# EAGLE design EEZ DIB BP3C r1B4 (EAGLE 7.2.0)
Assembly variants: Farnell, TME

## Sheet 1 of 2
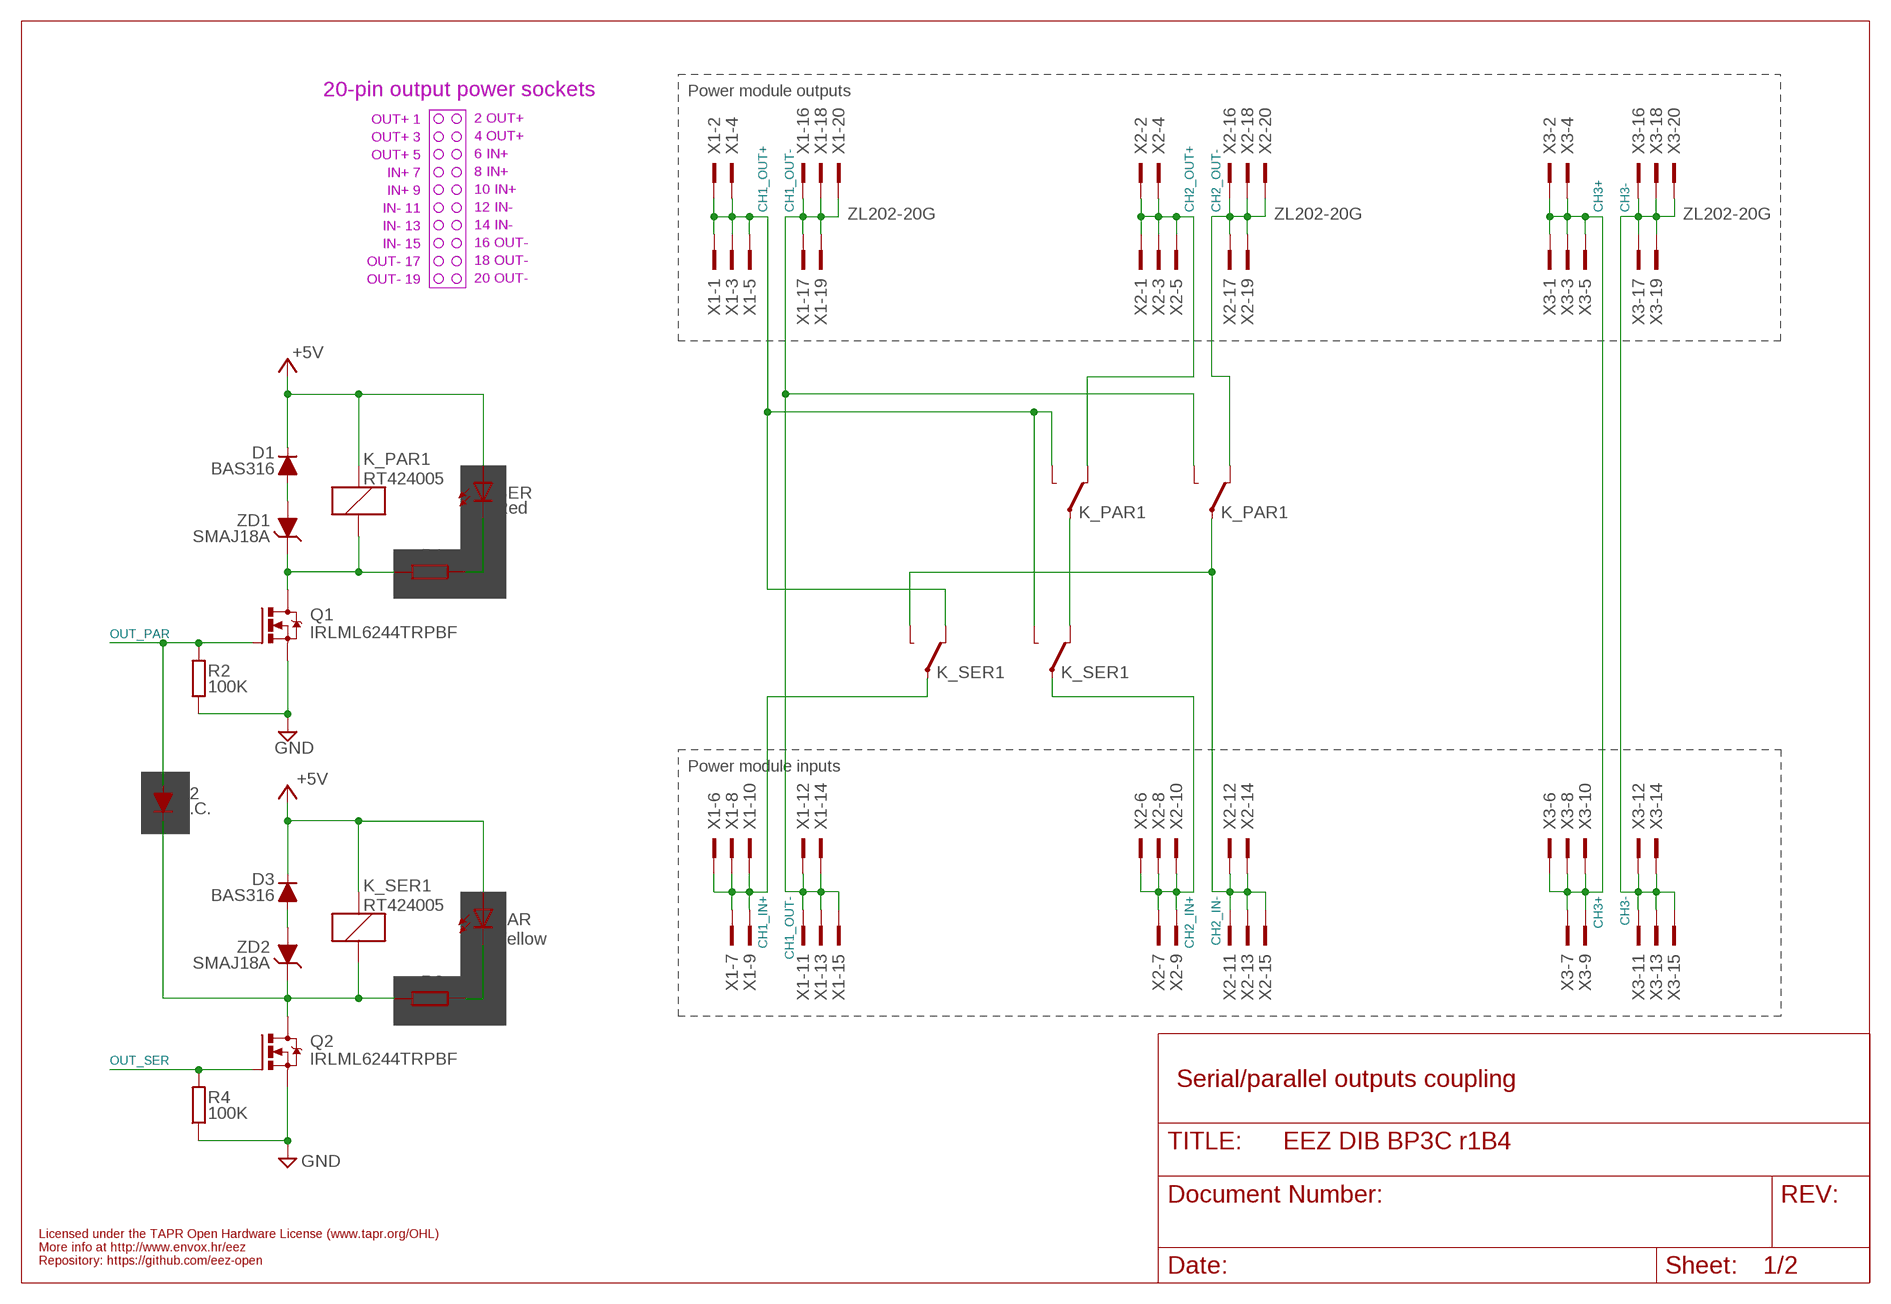
[diagram p0: schematic, sheet 1]

### Parts
D1  BAS316  DIODESOD323R  [SOD323-R]
D2  N.C.  DIODESOD323R  [SOD323-R]
D3  BAS316  DIODESOD323R  [SOD323-R]
K_PAR1  RT424005  RELAY_RT314012-2  [RT-C/016A5_ROUND]
K_SER1  RT424005  RELAY_RT314012-2  [RT-C/016A5_ROUND]
PAR  Yellow  LED0805  [LED_0805]
Q1  IRLML6244TRPBF  2N7002  [SOT103P240X110-3N]
Q2  IRLML6244TRPBF  2N7002  [SOT103P240X110-3N]
R1  330R  R-EU_R0805  [R0805]
R2  100K  R-EU_R0805  [R0805]
R3  330R  R-EU_R0805  [R0805]
R4  100K  R-EU_R0805  [R0805]
SER  Red  LED0805  [LED_0805]
X1  ZL202-20G  DS1021-210SF11  [DS1021-2*10SF11]
X2  ZL202-20G  DS1021-210SF11  [DS1021-2*10SF11]
X3  ZL202-20G  DS1021-210SF11  [DS1021-2*10SF11]
ZD1  SMAJ18A  PSMAXX  [DO214AC]
ZD2  SMAJ18A  PSMAXX  [DO214AC]

### Nets
+5V: D1.C D3.C K_PAR1.A2(K:C1) K_SER1.A2(K:C1) PAR.A SER.A ; also sheet 2
CH1_IN+: K_SER1.11A(-1:P) X1.6 X1.7 X1.8 X1.9 X1.10
CH1_OUT+: K_PAR1.14A(-1:O) K_SER1.12A(-1:S) K_SER1.14B(-2:O) X1.1 X1.2 X1.3 X1.4 X1.5
CH1_OUT-: K_PAR1.14B(-2:O) X1.11 X1.12 X1.13 X1.14 X1.15 X1.16 X1.17 X1.18 X1.19 X1.20
CH2_IN+: K_SER1.11B(-2:P) X2.6 X2.7 X2.8 X2.9 X2.10
CH2_IN-: K_PAR1.11B(-2:P) K_SER1.14A(-1:O) X2.11 X2.12 X2.13 X2.14 X2.15
CH2_OUT+: K_PAR1.12A(-1:S) X2.1 X2.2 X2.3 X2.4 X2.5
CH2_OUT-: K_PAR1.12B(-2:S) X2.16 X2.17 X2.18 X2.19 X2.20
CH3+: X3.1 X3.2 X3.3 X3.4 X3.5 X3.6 X3.7 X3.8 X3.9 X3.10
CH3-: X3.11 X3.12 X3.13 X3.14 X3.15 X3.16 X3.17 X3.18 X3.19 X3.20
GND: Q1.2(S) Q2.2(S) R2.1 R4.1 ; also sheet 2
N$1: K_PAR1.11A(-1:P) K_SER1.12B(-2:S)
N$7: PAR.C R3.1
N$8: R1.1 SER.C
N$101: D2.C K_SER1.A1(K:C2) Q2.3(D) R3.2 ZD2.C
N$102: K_PAR1.A1(K:C2) Q1.3(D) R1.2 ZD1.C
N$104: D3.A ZD2.A
N$128: D1.A ZD1.A
OUT_PAR: D2.A Q1.1(G) R2.2 ; also sheet 2
OUT_SER: Q2.1(G) R4.2 ; also sheet 2

### Notes on the sheet
- 20-pin output power sockets | Power module outputs
- OUT+ 1
- 2 OUT+
- OUT+ 3
- 4 OUT+
- OUT+ 5
- 6 IN+
- IN+ 7
- 8 IN+
- IN+ 9
- 10 IN+
- IN- 11
- 12 IN-
- IN- 13
- 14 IN-
- IN- 15
- 16 OUT-
- OUT- 17
- 18 OUT-
- OUT- 19
- 20 OUT-
- Power module inputs
- Serial/parallel outputs coupling
- Licensed under the TAPR Open Hardware License (www.tapr.org/OHL)
- More info at http://www.envox.hr/eez
- Repository: https://github.com/eez-open

## Sheet 2 of 2
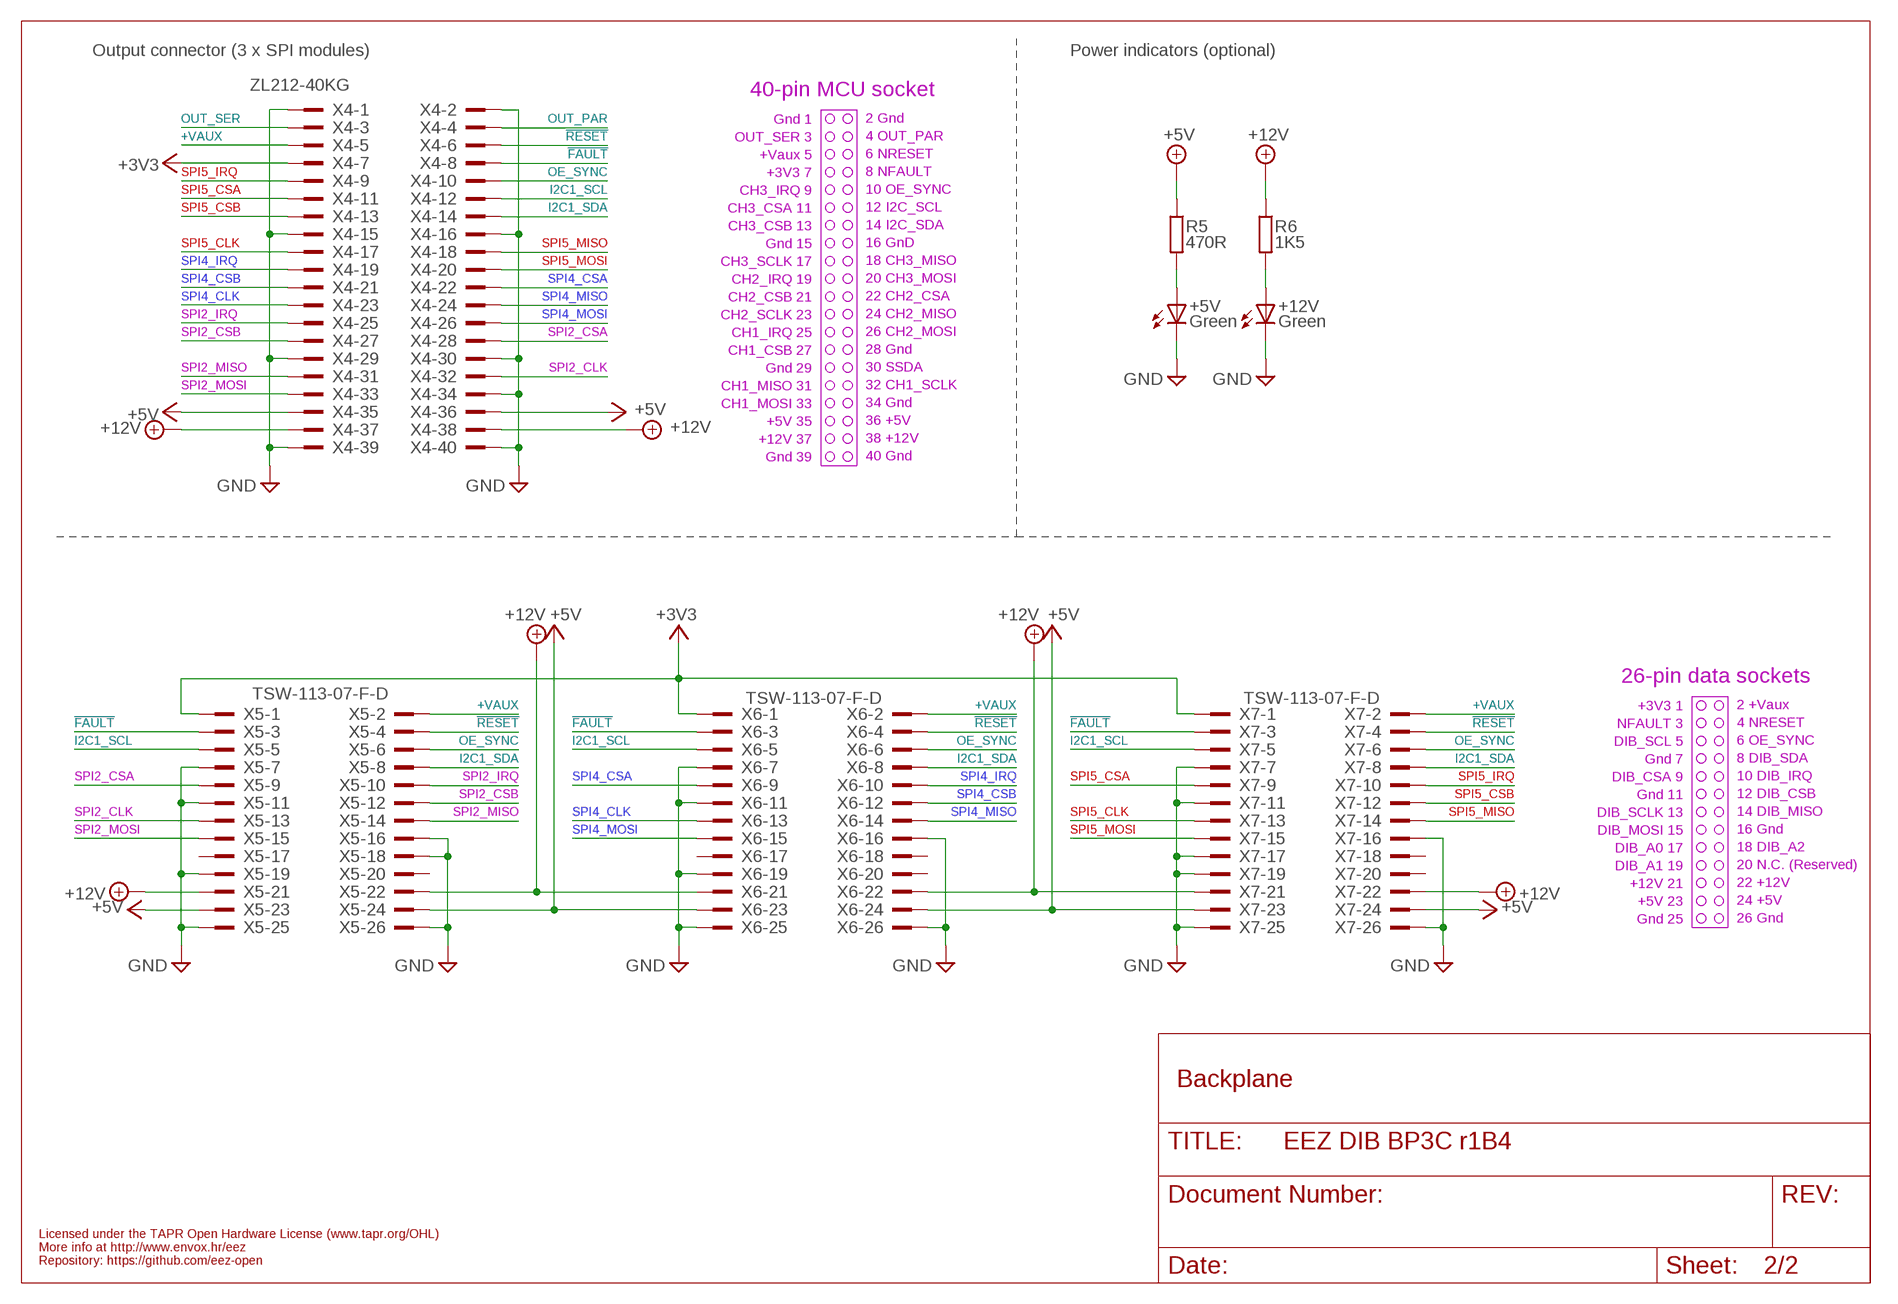
[diagram p1: schematic, sheet 2]

### Parts
+5V  Green  LED0805  [LED_0805]
+12V  Green  LED0805  [LED_0805]
R5  470R  R-EU_R0805  [R0805]
R6  1K5  R-EU_R0805  [R0805]
X4  ZL212-40KG  [ZL212-40KG]
X5  TSW-113-07-F-D  [TSW-113-07-F-D]
X6  TSW-113-07-F-D  [TSW-113-07-F-D]
X7  TSW-113-07-F-D  [TSW-113-07-F-D]

### Nets
!FAULT: X4.8 X5.3 X6.3 X7.3
!RESET: X4.6 X5.4 X6.4 X7.4
+3V3: X4.7 X5.1 X6.1 X7.1
+5V: R5.1 X4.35 X4.36 X5.23 X5.24 X6.23 X6.24 X7.23 X7.24 ; also sheet 1
+12V: R6.1 X4.37 X4.38 X5.21 X5.22 X6.21 X6.22 X7.21 X7.22
+VAUX: X4.5 X5.2 X6.2 X7.2
GND: +5V.C +12V.C X4.1 X4.2 X4.15 X4.16 X4.29 X4.30 X4.34 X4.39 X4.40 X5.7 X5.11 X5.16 X5.18 X5.19 X5.25 X5.26 X6.7 X6.11 X6.16 X6.19 X6.25 X6.26 X7.7 X7.11 X7.16 X7.17 X7.19 X7.25 X7.26 ; also sheet 1
I2C1_SCL: X4.12 X5.5 X6.5 X7.5
I2C1_SDA: X4.14 X5.8 X6.8 X7.8
N$3: +5V.A R5.2
N$4: +12V.A R6.2
OE_SYNC: X4.10 X5.6 X6.6 X7.6
OUT_PAR: X4.4 ; also sheet 1
OUT_SER: X4.3 ; also sheet 1
SPI2_CLK: X4.32 X5.13
SPI2_CSA: X4.28 X5.9
SPI2_CSB: X4.27 X5.12
SPI2_IRQ: X4.25 X5.10
SPI2_MISO: X4.31 X5.14
SPI2_MOSI: X4.33 X5.15
SPI4_CLK: X4.23 X6.13
SPI4_CSA: X4.22 X6.9
SPI4_CSB: X4.21 X6.12
SPI4_IRQ: X4.19 X6.10
SPI4_MISO: X4.24 X6.14
SPI4_MOSI: X4.26 X6.15
SPI5_CLK: X4.17 X7.13
SPI5_CSA: X4.11 X7.9
SPI5_CSB: X4.13 X7.12
SPI5_IRQ: X4.9 X7.10
SPI5_MISO: X4.18 X7.14
SPI5_MOSI: X4.20 X7.15
Unconnected: X5.17 X5.20 X6.17 X6.18 X6.20 X7.18 X7.20

### Notes on the sheet
- Output connector (3 x SPI modules) | Power indicators (optional)
- 40-pin MCU socket
- Gnd 1
- 2 Gnd
- OUT_SER 3
- 4 OUT_PAR
- +Vaux 5
- 6 NRESET
- +3V3 7
- 8 NFAULT
- CH3_IRQ 9
- 10 OE_SYNC
- CH3_CSA 11
- 12 I2C_SCL
- CH3_CSB 13
- 14 I2C_SDA
- Gnd 15
- 16 GnD
- CH3_SCLK 17
- 18 CH3_MISO
- CH2_IRQ 19
- 20 CH3_MOSI
- CH2_CSB 21
- 22 CH2_CSA
- CH2_SCLK 23
- 24 CH2_MISO
- CH1_IRQ 25
- 26 CH2_MOSI
- CH1_CSB 27
- 28 Gnd
- Gnd 29
- 30 SSDA
- CH1_MISO 31
- 32 CH1_SCLK
- CH1_MOSI 33
- 34 Gnd
- +5V 35
- 36 +5V
- +12V 37
- 38 +12V
- Gnd 39
- 40 Gnd
- 26-pin data sockets
- +3V3 1
- 2 +Vaux
- NFAULT 3
- 4 NRESET
- DIB_SCL 5
- 6 OE_SYNC
- Gnd 7
- 8 DIB_SDA
- DIB_CSA 9
- 10 DIB_IRQ
- Gnd 11
- 12 DIB_CSB
- DIB_SCLK 13
- 14 DIB_MISO
- DIB_MOSI 15
- 16 Gnd
- DIB_A0 17
- 18 DIB_A2
- DIB_A1 19
- 20 N.C. (Reserved)
- +12V 21
- 22 +12V
- +5V 23
- 24 +5V
- Gnd 25
- 26 Gnd
- Backplane
- Licensed under the TAPR Open Hardware License (www.tapr.org/OHL)
- More info at http://www.envox.hr/eez
- Repository: https://github.com/eez-open

## Library data of the parts
+5V +12V PAR SER = EEZ_Lib1:LED
D1-D3 = EEZ_Lib1:DIODE
K_PAR1 K_SER1 = EEZ_Lib1:RELAY_RT314012
Q1 Q2 = EEZ_Lib1:2N7002: N-CHANNEL ENHANCEMENT MODE FIELD EFFECT TRANSISTOR; MPN: 2N7002-7-F; OC_FARNELL: 1713823; OC_NEWARK: 25R5679; PACKAGE: SOT-23-3; SUPPLIER: DIODES INC.
R1-R6 = rcl:R-EU_: RESISTOR, European symbol
X1-X3 = EEZ_connectors:DS1021-2*10SF11: Pin header; pin strips; male; PIN:20; straight; 2.54mm; THT; 2x10; FARNELL: 2025179
X4 = EEZ_connectors:ZL212-40KG
X5-X7 = EEZ_connectors:TSW-113-07-F-D: Samtec TSW-110-07-F-D Header, 2.54MM, THT, 26-way; FARNELL: 2025182
ZD1 ZD2 = EEZ_Lib1:PSMAXX: Transient Voltage Suppressor, TVS, P4SMA Series, Unidirectional

## Net classes
0 default: width 0.152 mm, drill 0.3 mm, clearance 0.152 mm
1 diff: width 0.152 mm, drill 0.3 mm, clearance 0.152 mm
2 gnd: width 0.152 mm, drill 0.3 mm, clearance 0.152 mm

## Board
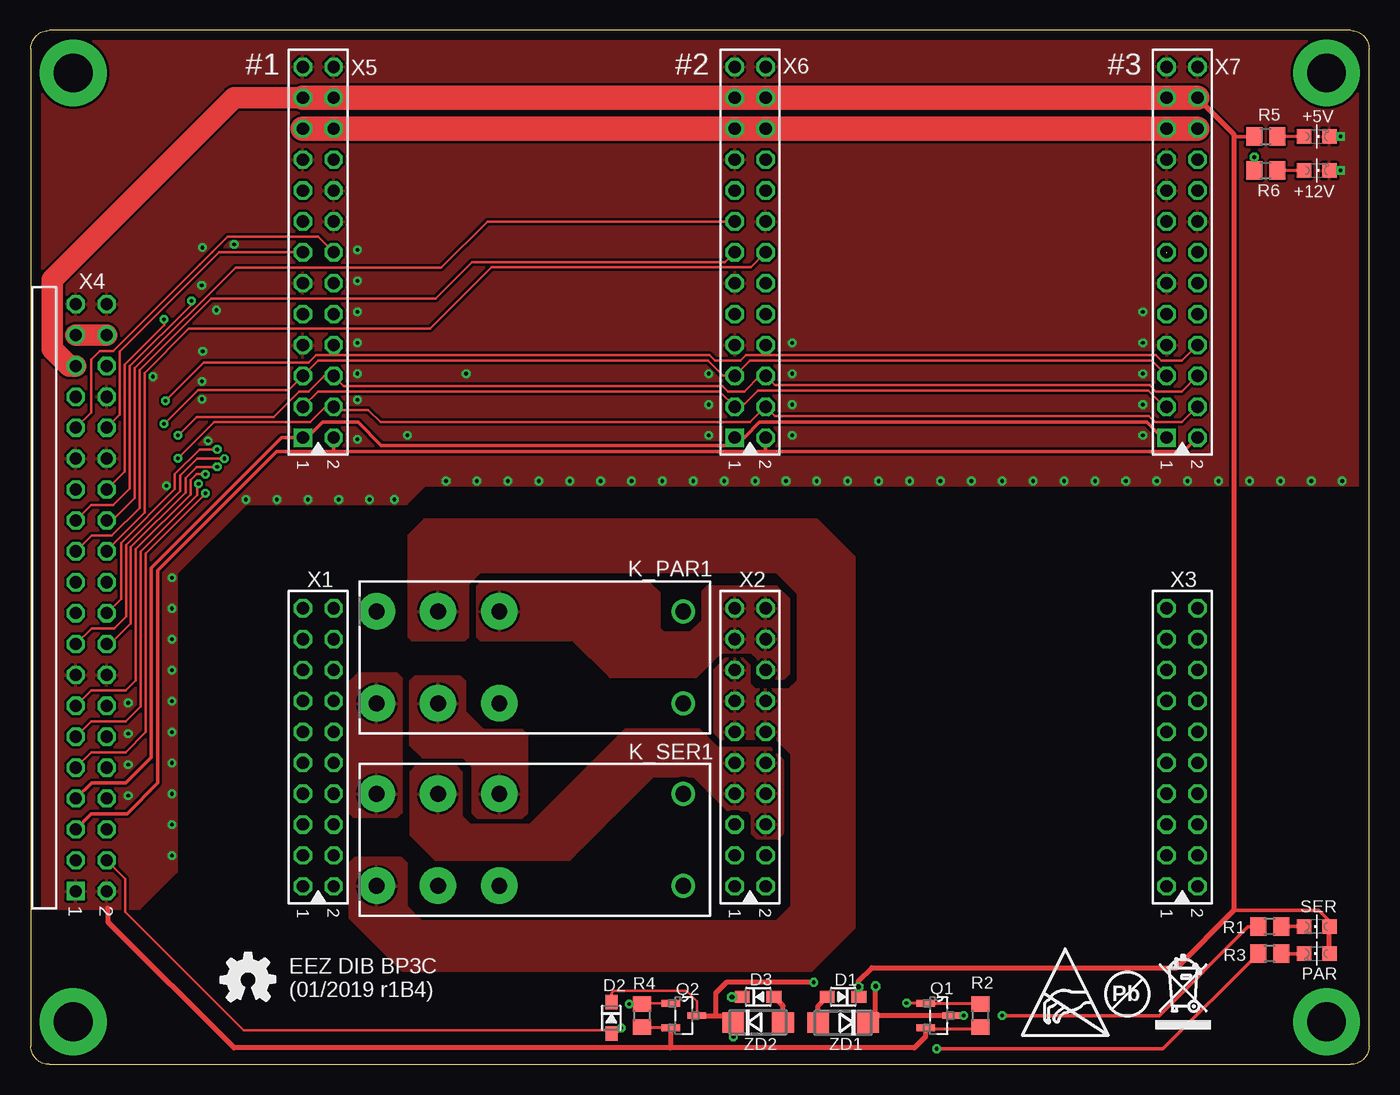
[diagram p2: board, top side]
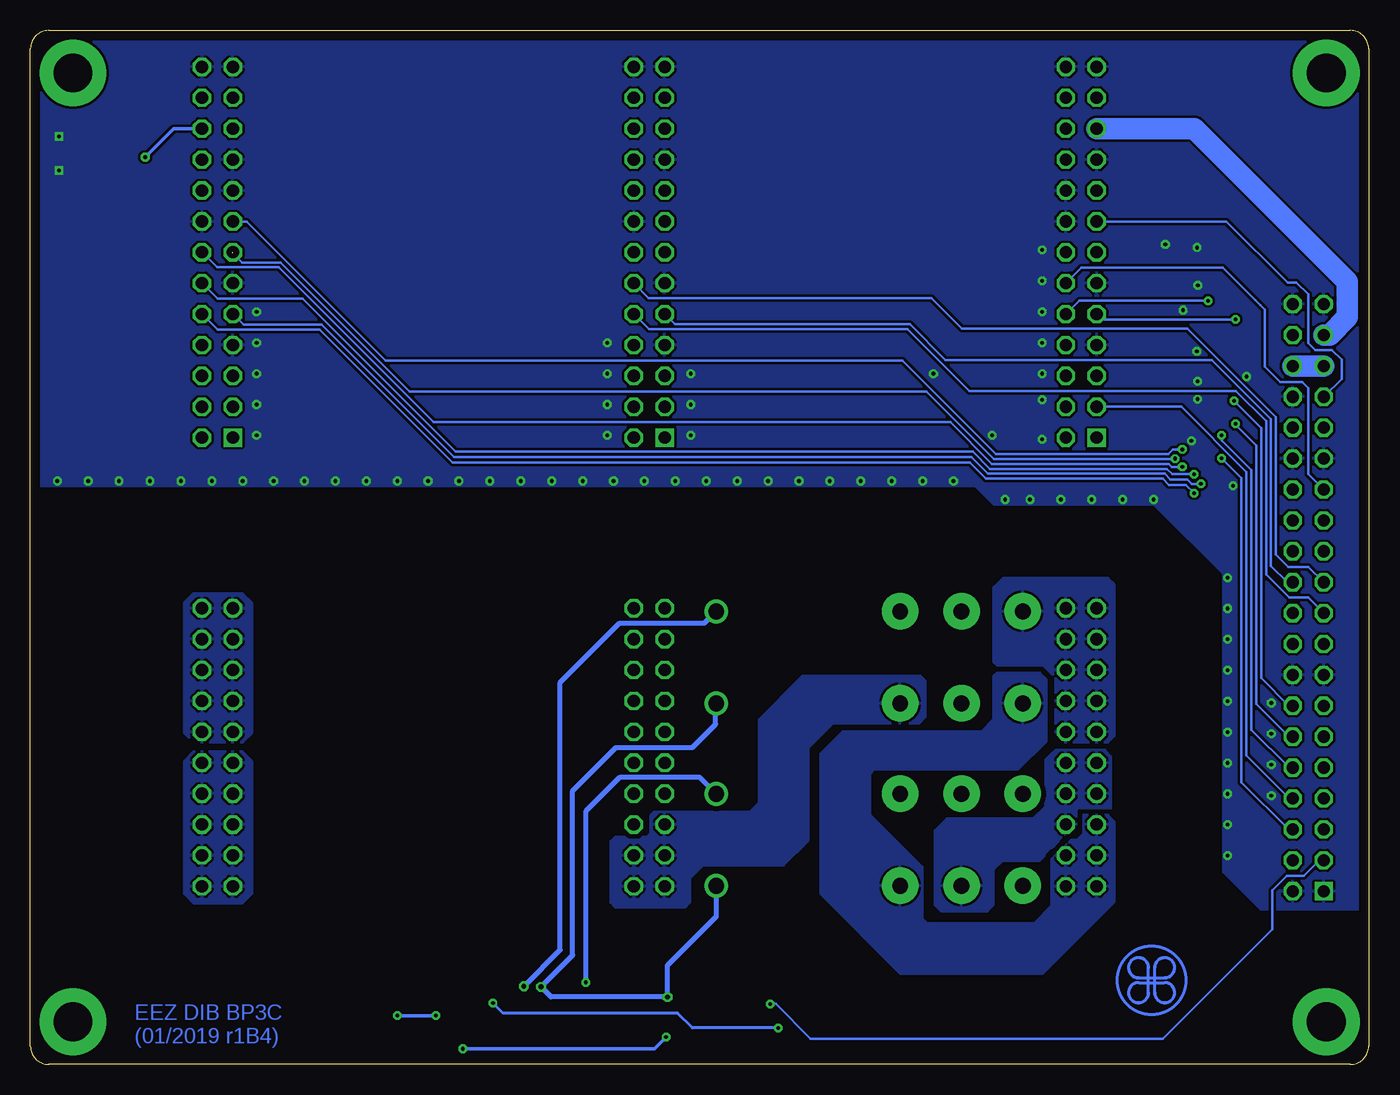
[diagram p3: board, bottom side, seen from below]

Size 110 x 85 mm. Coordinates in mm from the lower left corner, seen from the top.
Outline: 1.5,0 108.5,0 arc90 110,1.5 110,83.5 arc90 108.5,85 1.5,85 arc90 0,83.5 0,1.5 arc90 1.5,0
Copper layers (1*16): Top 0.035mm / dielectric 1.5mm / Bottom 0.035mm
Design rules "default *": minimum track width 6mil, minimum drill 0.3mm, track to track 4mil, track to pad 4mil, pad to pad 4mil, via to via 4mil, smd to smd 4mil, copper to edge 30mil, drill to drill 8mil, minimum pad ring 4mil, minimum via ring 8mil, stop-mask expansion 2.5mil, vias tented up to drill 0.6mm, thermal gap 8mil

### Footprints (pad centres in the part's own frame; a part is rotated, then mirrored left to right if it is on the bottom)
LED_0805 = smd 1.2 x 1.2: A 0,-1.05; C 0,1.05
SOD323-R = smd 1.2 x 1: A 1.3,0; C -1.3,0
RT-C/016A5_ROUND = drill 1.3 pad 3: 11A 8.83,3.78; 11B 8.83,-3.78; 12A 3.79,3.78; 12B 3.79,-3.78; 14A 13.87,3.78; 14B 13.87,-3.78 | drill 1.3: A1 -11.33,-3.78; A2 -11.33,3.78
SOT103P240X110-3N = smd 1.524 x 0.559: 1 -1.079,1.016; 2 -1.079,-1.016; 3 1.079,0
R0805 = smd 1.3 x 1.5: 1 -0.95,0; 2 0.95,0
DS1021-2*10SF11 = drill 1 pad 1.5 octagon: 1 22.86,0; 2 22.86,2.54; 3 20.32,0; 4 20.32,2.54; 5 17.78,0; 6 17.78,2.54; 7 15.24,0; 8 15.24,2.54; 9 12.7,0; 10 12.7,2.54; 11 10.16,0; 12 10.16,2.54; 13 7.62,0; 14 7.62,2.54; 15 5.08,0; 16 5.08,2.54; 17 2.54,0; 18 2.54,2.54; 19 0,0; 20 0,2.54
ZL212-40KG = drill 1 pad 1.5 square: 1 48.26,0 | drill 1 pad 1.5 octagon: 2 48.26,2.54; 3 45.72,0; 4 45.72,2.54; 5 43.18,0; 6 43.18,2.54; 7 40.64,0; 8 40.64,2.54; 9 38.1,0; 10 38.1,2.54; 11 35.56,0; 12 35.56,2.54; 13 33.02,0; 14 33.02,2.54; 15 30.48,0; 16 30.48,2.54; 17 27.94,0; 18 27.94,2.54; 19 25.4,0; 20 25.4,2.54; 21 22.86,0; 22 22.86,2.54; 23 20.32,0; 24 20.32,2.54; 25 17.78,0; 26 17.78,2.54; 27 15.24,0; 28 15.24,2.54; 29 12.7,0; 30 12.7,2.54; 31 10.16,0; 32 10.16,2.54; 33 7.62,0; 34 7.62,2.54; 35 5.08,0; 36 5.08,2.54; 37 2.54,0; 38 2.54,2.54; 39 0,0; 40 0,2.54
TSW-113-07-F-D = drill 1 pad 1.5 square: 1 30.48,0 | drill 1 pad 1.5 octagon: 2 30.48,2.54; 3 27.94,0; 4 27.94,2.54; 5 25.4,0; 6 25.4,2.54; 7 22.86,0; 8 22.86,2.54; 9 20.32,0; 10 20.32,2.54; 11 17.78,0; 12 17.78,2.54; 13 15.24,0; 14 15.24,2.54; 15 12.7,0; 16 12.7,2.54; 17 10.16,0; 18 10.16,2.54; 19 7.62,0; 20 7.62,2.54; 21 5.08,0; 22 5.08,2.54; 23 2.54,0; 24 2.54,2.54; 25 0,0; 26 0,2.54
DO214AC = smd 1.8 x 1.7: A 2.05,0; C -2.05,0

### Placement (x,y rotation side)
+5V  105.69,76.28 270 top
+12V  105.69,73.49 270 top
D1  66.77,5.55 180 top
D2  47.72,3.84 270 top
D3  59.78,5.55 0 top
EEZ_SIGNATURE  SIGNATURESMALL  [SIGNATURE_5MM]  17.84,6.93 180 top
K_PAR1  42.3,33.46 180 top
K_SER1  42.3,18.46 180 top
PAR  105.69,9.11 90 top
Q1  74.63,4.02 0 top
Q2  53.68,4.02 0 top
R1  101.83,11.33 180 top
R2  78.06,4.02 90 top
R3  101.83,9.11 180 top
R4  50.25,4.02 90 top
R5  101.5,76.28 0 top
R6  101.5,73.49 0 top
SER  105.69,11.33 90 top
U$2  [RECYCLE_BIN1/8]  92.43,2.88 0 top
U$4  [ESD_SYMBOL]  81.47,2.41 0 top
U$5  [PB_SMALL]  90.13,5.79 180 top
X1  22.36,37.5 270 top
X2  57.86,37.5 270 top
X3  93.36,37.5 270 top
X4  3.7,62.5 270 top
X5  22.36,82 270 top
X6  57.86,82 270 top
X7  93.36,82 270 top
ZD1  66.77,3.45 180 top
ZD2  59.78,3.45 0 top

### Tracks (layer width: path | path; a pad name or v marks a point on that pad's centre or on a via)
!FAULT
  Top 0.203: X7.3 93.18,54.06 91.85,55.39 59.78,55.39 58.46,54.06 X6.3 56.59,55.33 23.62,55.33 X5.3
  Bottom 0.203: X4.8 6.54,21.86 10.06,25.38 10.06,48.72 15.4,54.06 X5.3
!RESET  (via drill 0.3)
  Top 0.203: X7.4 94.62,52.78 92.42,52.78 91.92,53.29 61.17,53.29 X6.4 59.12,52.78 28.73,52.78 27.72,53.8 25.49,53.8 25.23,54.06 X5.4 24.23,54.06 22.95,52.78 15.06,52.78 v12.09,49.81
  Bottom 0.203: X4.6 6.59,19.32 10.46,23.2 10.46,48.19 v12.09,49.81
+3V3
  Top 0.305: X4.7 4.99,23.15 7.81,23.15 9.91,25.24 9.91,40.82 20.61,51.52 X5.1 22.7,51.52 23.97,52.78 26.89,52.78 28.8,50.88 57.22,50.88 X6.1 58.65,51.52 59.91,52.78 91.72,52.78 92.99,51.52 X7.1
+5V  (via drill 0.4)  (1 unrouted)
  Top 0.305: R5.1 98.9,76.28 | SER.A 106.75,11.79 105.89,12.65 98.9,12.65
  Top 0.406: X7.24 98.9,76.46 98.9,76.28 98.9,12.65 94.2,7.95 69.12,7.95 68.04,6.87 v68.04,6.37 68.07,6.34 D1.C | PAR.A SER.A | v57.62,5.54 D3.C
  Top 1.778: X5.23 16.7,79.46 1.74,64.5 1.74,58.82 3.14,57.42 X4.35
  Top 2.032: X7.24 X7.23 X6.24 X6.23 X5.24 X5.23
  Bottom 0.406: K_PAR1.A2 53.69,29.62 53.69,27.96 55.59,26.05 61.88,26.05 65.44,22.5 65.44,8.97 v68.04,6.37 67.21,5.54 v57.62,5.54 | 57.64,5.55 57.64,8.13 53.63,12.14 K_SER1.A2
  Bottom 1.778: X4.36 X4.35
+12V  (via drill 0.3)
  Top 0.305: R6.1 100.55,74.57 v100.56,74.58
  Top 1.778: X4.38 X4.37
  Top 2.032: X7.22 X7.21 X6.22 X6.21 X5.22 X5.21
  Bottom 0.305: X7.22 98.22,76.92 v100.56,74.58
  Bottom 1.778: X5.21 14.32,76.92 1.74,64.34 1.74,61.42 3.21,59.96 X4.37
+VAUX
  Top 0.305: X4.5 3.7,19.34 4.97,20.61 7.91,20.61 10.45,23.14 10.45,40.59 20.22,50.37 24.92,50.37 | X7.2 94.75,50.37 60.42,50.37 | 60.42,50.37 24.92,50.37 | X6.2 60.4,50.39 60.42,50.37 | X5.2 24.9,50.4 24.92,50.37
CH1_IN+
  pour Bottom (isolate 0.406, rank 3): 21.18,25.29 21.68,25.82 25.75,25.82 26,25.57 26,25.61 26.57,25.04 26.57,21.18 27.59,20.17 34.64,20.23 35.65,19.21 35.65,13.12 35.15,12.61 31.34,12.61 30.83,13.12 30.83,16.02 30.07,16.78 27.02,16.78 25.37,18.43 24.22,18.43 23.72,18.94 21.43,18.94 21.18,19.19
CH1_OUT+
  pour Bottom (isolate 0.305): 26.51,31.64 27.02,32.15 30.57,32.15 30.83,31.91 30.83,28.36 31.84,27.32 43.27,27.32 45.05,25.54 45.05,14.05 38.51,7.51 26.76,7.51 20.92,13.35 20.92,19.96 21.43,20.48 23.46,20.48 23.46,18.94 23.97,18.43 24.48,18.43 26.07,16.84 26.07,13.03 27.53,11.57 36.29,11.57 36.67,11.95 36.67,16.21 40.99,20.53 40.99,23.89 40.61,24.27 28.8,24.27 26.51,26.56
  pour Top (isolate 0.406): 26.19,31.39 26.95,32.15 30.07,32.15 30.45,31.77 30.45,20.72 30.07,20.34 26.57,20.34 26.19,20.72
CH1_OUT-
  pour Bottom (isolate 0.406): 20.92,39.45 21.43,39.96 30.07,39.96 30.57,39.45 30.83,39.2 30.83,33.1 30.57,32.85 26.76,32.85 25.75,31.83 25.75,26.75 25.49,26.5 21.43,26.5 21.18,26.75 20.92,27
CH2_IN+
  pour Top (isolate 0.406): 54.45,23.7 57.24,20.91 58.9,20.91 59.28,20.53 59.28,19 59.66,18.62 61.44,18.62 61.82,19 61.82,24.97 60.8,25.99 56.48,25.99 54.96,27.51 48.86,27.51 40.99,19.64 36.16,19.64 35.4,20.4 35.4,24.02 35.02,24.4 31.59,24.4 31.21,24.02 31.21,18.88 33.24,16.84 44.29,16.84 51.15,23.7
CH2_IN-
  pour Top (isolate 0.406): 35.91,35.13 35.65,34.88 31.34,34.88 31.08,35.13 31.08,43.51 32.35,44.78 64.61,44.78 67.66,41.74 67.66,11.19 64.17,7.7 30.57,7.7 26.26,12.02 26.26,16.59 26.64,16.97 30.45,16.97 30.83,16.59 30.83,13.03 32.1,11.76 61.31,11.76 62.58,13.03 62.58,25.48 61.31,26.75 56.74,26.75 56.23,27.26 56.23,32.47 57.12,33.35 58.51,33.35 59.02,32.85 59.02,31.32 59.53,30.81 62.32,30.81 63.09,31.58 63.09,38.69 61.31,40.47 36.92,40.47 35.91,39.45
CH2_OUT+
  pour Bottom (isolate 0.406): 50.89,20.72 58.77,20.72 59.02,20.46 59.02,18.94 59.28,18.69 61.94,18.69 62.32,18.3 62.32,13.35 61.94,12.97 56.16,12.97 55.78,13.35 55.78,15.32 54.7,16.4 48.1,16.4 46.07,18.43 46.07,26.05 44.04,28.08 36.92,28.08 36.42,28.59 36.42,31.51 36.8,31.89 46.58,31.89 50.13,28.34 50.13,21.48
CH2_OUT-
  pour Top (isolate 0.305): 59.78,33.35 59.78,32.15 60.16,31.77 61.94,31.77 62.32,32.15 62.32,38.24 61.31,39.26 55.59,39.26 55.21,38.88 55.21,36.47 54.2,35.45 52.04,35.45 51.66,35.83 51.66,38.75 50.89,39.51 36.92,39.51 36.67,39.26 36.67,35.2 36.92,34.94 44.54,34.94 47.59,31.89 54.7,31.89 56.74,33.93 59.21,33.93
CH3+
  pour Bottom (isolate 0.305, rank 2): 91.79,24.91 92.55,25.67 96.61,25.67 97.38,24.91 97.38,14.05 96.61,13.29 92.55,13.29 91.79,14.05
CH3-
  pour Bottom (isolate 0.305): 91.79,37.93 92.55,38.69 96.61,38.69 97.38,37.93 97.38,27.26 96.61,26.5 92.55,26.5 91.79,27.26
GND  (via drill 0.3)
  Top 0.254: Q2.2 50.31,3 R4.1 | 73.56,2.94 77.93,2.94 R2.1
  Top 0.406: 52.55,1.35 72.61,1.35 73.56,2.3 73.56,2.94 Q1.2 | 52.55,1.35 16.7,1.35 6.35,11.7 6.35,12.78 6.29,12.84 | Q2.2 52.6,1.4 52.55,1.35
  other vias: 8,22.1 91.41,59.33 107.66,73.49 107.66,76.28 8,24.64 8,27.18 8,29.72 55.72,54.25 62.58,54.25 26.83,54.63 91.41,54.25 91.41,56.79 91.41,61.87 10.05,56.54 91.41,51.71 62.58,56.79 62.58,59.33 55.72,56.79 26.83,56.79 26.83,59.33 26.83,61.87 26.83,64.41 26.83,66.95 55.72,51.71 26.83,51.39 62.58,51.71 35.78,56.79 56.99,47.96 59.53,47.96 67.15,47.96 62.07,47.96 69.69,47.96 64.61,47.96 72.23,47.96 74.77,47.96 77.31,47.96 14.11,67.15 14.05,64.04 14.06,56.15 14.06,54.69 14.13,58.63 79.85,47.96 82.39,47.96 84.93,47.96 87.47,47.96 90.01,47.96 92.55,47.96 95.09,47.96 97.63,47.96 102.71,47.96 100.17,47.96 105.25,47.96 107.79,47.96 29.88,46.44 27.84,46.44 25.3,46.44 22.76,46.44 20.22,46.44 17.68,46.44 14.57,51.26 15.25,62.01 16.71,67.4 30.95,51.71 54.45,47.96 51.91,47.96 49.37,47.96 46.83,47.96 44.29,47.96 41.75,47.96 39.21,47.96 36.67,47.96 34.13,47.96 11.59,40.02 11.59,37.48 11.59,34.94 11.59,32.4 11.59,29.86 11.59,27.32 11.59,24.78 11.59,22.24 11.59,19.7 11.59,17.16 11.14,47.58
  pour Bottom (isolate 0.203, rank 3): -0.51,85.68 110.58,85.68 110.58,47.58 32.35,47.58 30.83,46.05 17.68,46.05 11.97,40.34 11.97,15.83 8.89,12.78 -0.51,12.78
  pour Top (isolate 0.203, rank 3): -0.76,85.68 110.33,85.68 110.33,47.58 32.35,47.58 30.86,46.05 17.68,46.05 11.97,40.34 11.97,15.83 8.92,12.78 -0.79,12.78
HOLE_MCU1  (via drill 3.2 pad 5.5)
  other vias: 106.5,81.5
HOLE_MCU2  (via drill 3.2 pad 5.5)
  other vias: 3.5,81.5
HOLE_MCU3  (via drill 3.2 pad 5.5)
  other vias: 3.5,3.5
HOLE_MCU4  (via drill 3.2 pad 5.5)
  other vias: 106.5,3.5
I2C1_SCL  (via drill 0.3)
  Top 0.203: X7.5 93.36,56.63 92.13,57.87 59.09,57.87 57.86,56.63 X6.5 57.83,56.63 56.89,56.63 55.66,57.87 23.62,57.87 X5.5 22.32,56.6 21.18,55.45 13.75,55.45 v10.95,52.66
  Bottom 0.203: X4.12 6.54,26.94 9.25,29.65 9.25,50.88 10.95,52.59 v10.95,52.66
I2C1_SDA  (via drill 0.3)
  Top 0.203: 60.42,58.31 92.49,58.31 92.93,57.87 94.61,57.87 95.9,59.15 X7.8 | 60.42,58.31 58.77,58.31 58.32,57.87 56.23,57.87 55.78,58.31 24.86,58.31 | X5.8 24.9,58.35 24.86,58.31 | X6.8 60.4,58.33 60.42,58.31 | 24.86,58.31 23.46,58.31 22.83,57.67 14.19,57.67 v11.08,54.56
  Bottom 0.203: X4.14 6.55,29.48 8.84,31.77 8.84,52.32 v11.08,54.56
N$1
  pour Top (isolate 0.406): 31.21,31.51 31.59,31.89 35.27,31.89 35.65,31.51 35.65,29.04 37.18,27.51 40.35,27.51 40.73,27.13 40.73,20.65 40.35,20.27 36.73,20.27 36.35,20.65 36.35,24.46 35.59,25.23 32.23,25.23 31.21,26.24
N$3
  Top 0.254: +5V.A R5.2
N$4
  Top 0.254: +12V.A R6.2
N$7
  Top 0.305: PAR.C R3.1
N$8
  Top 0.305: SER.C R1.1
N$101  (via drill 0.3)
  Top 0.203: D2.C 47.72,5.86 47.91,6.05 53.88,6.05 54.76,5.17 Q2.3
  Top 0.305: v57.75,2.24 57.75,3.43 ZD2.C | 100.74,8.97 R3.2 93.06,1.29 v74.45,1.29
  Top 0.406: Q2.3 56.29,4.02 | 56.29,4.02 57.17,4.02 ZD2.C | v64.36,6.75 57.18,6.75 56.29,5.86 56.29,4.02
  Bottom 0.305: v74.45,1.29 58.7,1.29 v57.75,2.24
  Bottom 0.406: K_SER1.A1 54.96,23.57 61.56,23.57 64.36,20.78 v64.36,6.75
N$102  (via drill 0.3, 0.4)
  Top 0.254: Q1.3 v76.67,4.02
  Top 0.305: 100.63,11.08 R1.2 100.04,11.32 92.74,4.02 v79.85,4.02
  Top 0.406: Q1.3 69.44,4.02 | 69.44,4.02 ZD1.C | 69.44,4.02 v69.44,6.43
  Bottom 0.305: v79.85,4.02 v76.67,4.02
  Bottom 0.406: K_PAR1.A1 54.6,36.27 61.56,36.27 66.45,31.39 66.45,9.41 v69.44,6.43
N$104
  Top 0.406: ZD2.A 61.83,4.8 D3.A
N$128
  Top 0.406: ZD1.A 64.72,4.8 D1.A
OE_SYNC  (via drill 0.3)
  Top 0.203: X7.6 95.9,56.61 94.61,55.33 92.49,55.33 91.98,55.83 61.18,55.83 60.4,56.61 | X6.6 60.4,56.61 | 60.4,56.61 59.93,56.61 58.64,55.33 57.3,55.33 56.85,55.77 25.73,55.77 X5.6 24.1,56.6 22.83,55.33 22.06,55.33 19.97,53.23 13.62,53.23 v12.1,51.71
  Bottom 0.203: X4.10 6.54,24.4 9.65,27.52 9.65,48.88 12.06,51.29 12.06,51.71 v12.1,51.71
OUT_PAR  (via drill 0.3)
  Top 0.203: X4.4 7.75,15.27 7.75,12.53 17.48,2.79 47.47,2.79
  Top 0.254: R2.2 73.62,4.97 Q1.1 v71.98,5.03 | 48.08,2.18 D2.A | D2.A 48.08,2.54 v48.54,3 | 47.47,2.79 D2.A
  Bottom 0.254: v48.54,3 55.59,3 56.8,4.21 71.15,4.21 v71.98,5.03
OUT_SER  (via drill 0.3)
  Top 0.203: Q2.1 50.31,5.03 R4.2 v49.18,4.97
  Bottom 0.203: X4.3 4.06,16.78 5.34,15.5 6.73,15.5 7.94,14.3 7.94,11.1 16.92,2.11 45.88,2.11 48.73,4.97 v49.18,4.97
SPI2_CLK
  Top 0.203: X4.32 7.3,53.4 7.3,58.59 15.47,66.76 X5.13
SPI2_CSA  (via drill 0.3)
  Top 0.203: X4.28 7.71,48.73 7.71,57.54 10.95,60.78 v10.95,61.24
  Bottom 0.203: v10.95,61.24 21.92,61.24 X5.9
SPI2_CSB
  Bottom 0.203: X4.27 4.97,48.53 4.97,55.6 5.47,56.1 7.26,56.1 8.54,57.38 8.54,62.06 8.89,62.41 9.3,62.82 11.99,65.51 23.61,65.51 X5.12
SPI2_IRQ  (via drill 0.3)
  Top 0.203: X4.25 4.96,45.98 6.79,45.98 8.13,47.32 8.13,57.39 13.21,62.47 v13.21,62.78
  Bottom 0.203: v13.21,62.78 23.8,62.78 X5.10
SPI2_MISO
  Top 0.203: X4.31 4.97,53.61 4.97,57.95 5.68,58.66 6.79,58.66 13.87,65.74 14.89,66.75 16.18,68.05 23.62,68.05 24.88,66.79 X5.14
SPI2_MOSI
  Bottom 0.203: X4.33 2.22,56.36 2.22,57.92 3.02,58.72 4.39,58.72 4.98,59.31 4.98,63.32 5.94,64.28 6.67,64.28 11.69,69.3 X5.15
SPI4_CLK
  Top 0.203: X4.23 5,43.48 6.67,43.48 8.94,45.76 8.94,57.06 14.83,62.94 33.27,62.94 36.28,65.95 57.05,65.95 X6.13
SPI4_CSA
  Bottom 0.203: X4.22 6.67,39.64 8.03,40.99 8.03,53.03 12.9,57.9 34.78,57.9 37.72,60.85 57.03,60.85 X6.9
SPI4_CSB
  Bottom 0.203: X4.21 4.96,40.9 6.59,40.9 7.62,41.93 7.62,53.2 14.9,60.48 33.43,60.48 35.95,63 59.18,63 X6.12
SPI4_IRQ
  Bottom 0.203: X4.19 4.97,38.38 6.54,38.38 8.43,40.27 8.43,52.87 10.91,55.35 32.81,55.35 37.9,60.44 59.16,60.44 X6.10
SPI4_MISO
  Top 0.203: X6.14 59.18,65.54 37.88,65.54 32.82,60.48 12.98,60.48 9.35,56.85 9.35,45.37 6.24,42.26 X4.24
SPI4_MOSI
  Top 0.203: X6.15 37.53,69.3 33.74,65.51 16.82,65.51 8.53,57.23 8.53,46.56 6.69,44.72 X4.26
SPI5_CLK  (via drill 0.3)  (1 unrouted)
  Top 0.203: X4.17 4.99,35.85 6.86,35.85 7.82,36.81 7.82,42.69 12.29,47.16 12.29,48.4 13.68,49.8 v15.9,49.8
  Bottom 0.203: 93.36,66.69 92.6,65.93 89.44,65.93 78.83,55.33 36.35,55.33 30.8,49.77 15.93,49.77 v15.9,49.8
SPI5_CSA  (via drill 0.3)
  Top 0.203: X4.11 4.97,28.22 7.81,28.22 9.04,29.45 9.04,42.19 13.68,46.82 13.68,47.62 v13.79,47.73
  Bottom 0.203: X7.9 92.49,60.81 86.05,60.81 75.16,49.93 32.67,49.93 31.3,48.56 16.76,48.56 16.29,48.09 14.89,48.09 14.53,47.73 v13.79,47.73
SPI5_CSB  (via drill 0.3)
  Top 0.203: X4.13 4.96,30.74 7.81,30.74 8.64,31.57 8.64,42.35 13.14,46.86 13.14,48.02 13.64,48.52 v14.34,48.52
  Bottom 0.203: X7.12 95.9,64.23 94.63,62.96 87.62,62.96 75.04,50.37 32.54,50.37 31.13,48.96 16.59,48.96 16.14,48.52 v14.34,48.52
SPI5_IRQ  (via drill 0.3)
  Top 0.203: X4.9 4.96,25.66 7.8,25.66 9.45,27.31 9.45,42.02 14.34,46.91 v14.34,46.96
  Bottom 0.203: X7.10 95.9,61.69 94.61,60.41 86.21,60.41 75.29,49.48 32.8,49.48 31.46,48.15 16.92,48.15 16.41,47.64 15.02,47.64 v14.34,46.96
SPI5_MISO  (via drill 0.3)
  Top 0.203: X4.18 6.52,34.56 8.23,36.27 8.23,42.53 12.73,47.03 12.73,48.21 13.64,49.13 v15.32,49.13
  Bottom 0.203: X7.14 95.9,66.77 94.65,65.52 89.62,65.52 76.88,52.78 34.38,52.78 30.97,49.37 16.41,49.37 16.17,49.13 v15.32,49.13
SPI5_MOSI  (via drill 0.3)
  Top 0.203: X4.20 7.42,38.28 7.42,42.86 11.84,47.28 11.84,48.53 13.86,50.55 v15.32,50.55
  Bottom 0.203: X7.15 92.22,69.3 80.79,57.87 38.32,57.87 30.64,50.18 16.48,50.18 16.11,50.55 v15.32,50.55

### Text on the board
Bottom: EEZ DIB BP3C / (01/2019 r1B4)
tPlace: #1 | #2 | #3 | EEZ DIB BP3C / (01/2019 r1B4)